# Altium schematic sheet var_07_scheme.SchDoc
size A4; SheetNumber: 7; SheetTotal: 10
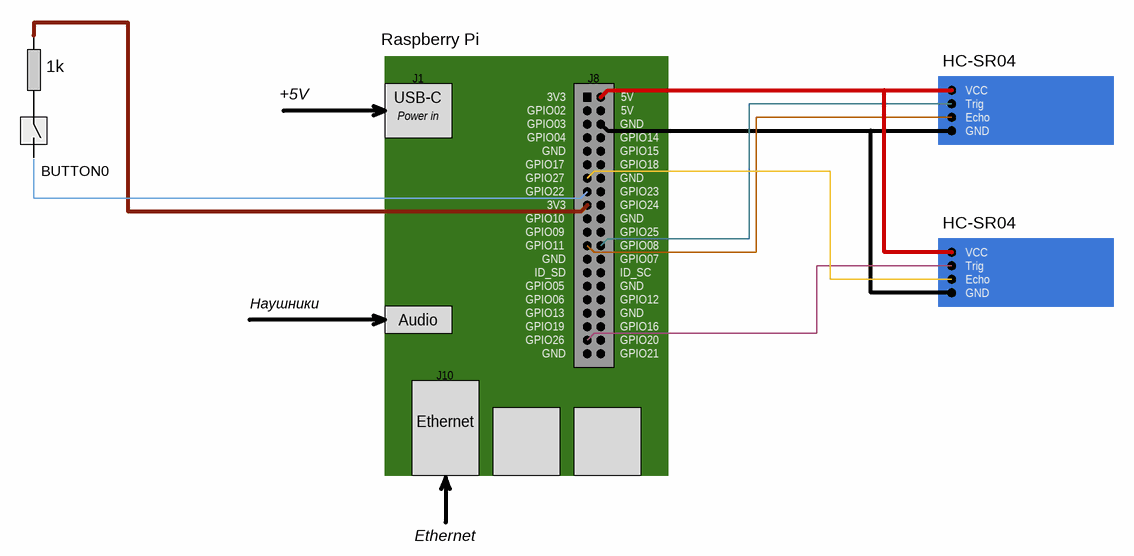
[diagram p0: var_07_scheme.SchDoc]

## Notes on the sheet
- 1k
- Raspberry Pi
- HC-SR04
- +5V
- USB-C
- Power in
- J1
- 3V3
- GPIO02
- GPIO03
- GPIO04
- J8
- GND
- GPIO14
- 5V
- VCC
- Trig
- Echo
- BUTTON0
- GPIO17
- GPIO27
- GPIO22
- GPIO15
- GPIO18
- GPIO23
- GPIO09
- GPIO10
- GPIO11
- ID_SD
- GPIO24
- GPIO25
- GPIO08
- GPIO07
- ID_SC
- Наушники
- Audio
- GPIO05
- GPIO06
- GPIO13
- GPIO19
- GPIO12
- GPIO16
- J10
- GPIO26
- GPIO20
- GPIO21
- Ethernet